# Altium schematic sheet Charging.SchDoc
size A; SheetNumber: 6
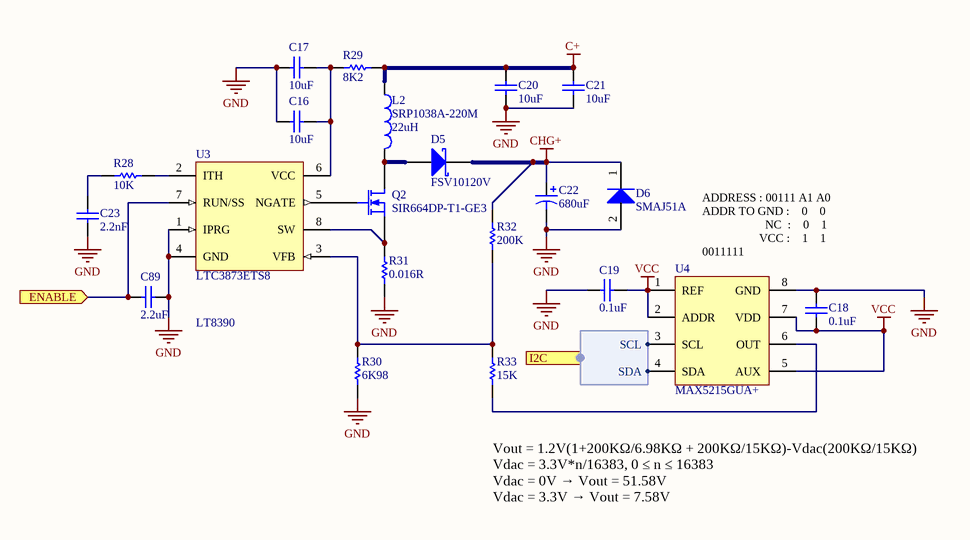
[diagram p0: Charging.SchDoc]

## Parts
C16  value 10uF  [C0603[1608X92]]  (hidden comment: 10uF 16V 0603)
C17  value 10uF  [C0603[1608X92]]  (hidden comment: 10uF 16V 0603)
C18  value 0.1uF  [C0603[1608X92]]  (hidden comment: 0.1uF 6.3V 0603)
C19  value 0.1uF  [C0603[1608X92]]  (hidden comment: 0.1uF 6.3V 0603)
C20  value 10uF  [C1206[3216X160]]  (hidden comment: 10uF 50V 1206)
C21  value 10uF  [C1206[3216X160]]  (hidden comment: 10uF 50V 1206)
C22  value 680uF  [CAP-ELECTROLYTIC[10.0x12.6]]  (hidden comment: 180uF 50V)
C23  value 2.2nF  [C0603[1608X92]]  (hidden comment: 2.2nF 50V 0603)
C89  value 2.2uF  [C0603[1608X92]]  (hidden comment: 2.2uF 10V 0603)
D5  FSV10120V  [TO-277]
D6  SMAJ51A  [DO-214AC]
L2  SRP1038A-220M  value 22uH  [SRP1038A]
Q2  SIR664DP-T1-GE3  [PowerPak-8]
R28  value 10K  [R0603[1608]]  (hidden comment: 10K 1% 0603)
R29  value 8K2  [R0603[1608]]  (hidden comment: 8K2 1% 0603)
R30  value 6K98  [R0603[1608]]  (hidden comment: 6K98 1% 0603)
R31  value 0.016R  [R1206[3216]]  (hidden comment: 0.016R 1% 1206)
R32  value 200K  [R0603[1608]]  (hidden comment: 200K 1% 0603)
R33  value 15K  [R0603[1608]]  (hidden comment: 15K 1% 0603)
U3  LTC3873ETS8  [SOT-23-8]
U4  MAX5215GUA+  [MSOP-8]

## Ports
ENABLE (in), I2C (harness I2C)

## Harnesses
I2C: SCL, SDA

## Nets
C+: C20.2 C21.2 L2.1 R29.2
CHG+: C22.1 D5.1(K) D6.1(K) R32.2
GND: C16.1 C17.1 C18.1 C19.2 C20.1 C21.1 C22.2 C23.1 C89.2 D6.2(A) R30.1 R31.1 U3.1(IPRG) U3.4(GND) U4.8(GND)
VCC: C18.2 C19.1 U4.1(REF) U4.2(ADDR) U4.5(AUX) U4.7(VDD)
ENABLE: C89.1 U3.7(RUN/SS) ; port ENABLE
NetC16_2: C16.2 C17.2 R29.1 U3.6(VCC)
NetC23_2: C23.2 R28.1
NetD5_2: D5.2(A) L2.2 Q2.3(D)
NetQ2_1: Q2.1(S) R31.2 U3.8(SW)
NetQ2_2: Q2.2(G) U3.5(NGATE)
NetR28_2: R28.2 U3.2(ITH)
NetR30_2: R30.2 R32.1 R33.2 U3.3(VFB)
NetR33_1: R33.1 U4.6(OUT)
NetU4_3: U4.3(SCL) ; port I2C.SCL
NetU4_4: U4.4(SDA) ; port I2C.SDA

## Notes on the sheet
- ADDRESS : 00111 A1 A0
  ADDR TO GND :    0    0
  NC  :    0    1
  VCC :    1    1
  0011111
- LT8390
- Vout = 1.2V(1+200KΩ/6.98KΩ + 200KΩ/15KΩ)-Vdac(200KΩ/15KΩ)
  Vdac = 3.3V*n/16383, 0 ≤ n ≤ 16383
  Vdac = 0V → Vout = 51.58V
  Vdac = 3.3V → Vout = 7.58V

## Library data of the parts
C16 C17 = CAP_10uF_16V_0603_10%: 10uF 16V 10% 0603 (1608 Metric); PartNumber: GRM188R61C106KAALD; Manufacturer: Murata; TemperatureCoefficient: X5R; Mounting Technology: Surface Mount; PackageReference: 0603; PackageDescription: 0603 (1608 Metric); Voltage: 16V; Tolerance: 10%
C18 C19 = CAP_0.1uF_6.3V_0603_10%: 0.1uF 6.3V 10% 0603 (1608 Metric); PartNumber: GRM188R70J104KA01D; Manufacturer: Murata; Mounting Technology: Surface Mount; PackageReference: 0603; PackageDescription: 0603 (1608 Metric); Voltage: 6.3V; Tolerance: 10%
C20 C21 = CAP_10uF_50V_1206_20%: 10uF 50V 20% 1206 (3216 Metric); PartNumber: UMK316BBJ106ML-T; Manufacturer: Taiyo Yuden; Tolerance: 20%; Mounting Technology: Surface Mount; PackageReference: 1206; PackageDescription: 1206 (3216 Metric); Voltage: 50V
C22 = CAP_180uF_50V_20%: 180uF 50V 20%; PartNumber: PCR1H181MCL1GS; Manufacturer: Nichicon; PackageReference: 1H; PackageDescription: 5mm; Mounting Technology: Surface Mount; Voltage: 50V; Tolerance: 20%
C23 = CAP_2.2nF_50V_0603_5%: 2.2nF 50V 5% 0603 (1608 Metric); PartNumber: GRM1885C1H222JA01D; Manufacturer: Murata; TemperatureCoefficient: C0G; Mounting Technology: Surface Mount; PackageReference: 0603; PackageDescription: 0603 (1608 Metric); Voltage: 50V; Tolerance: 5%
C89 = CAP_2.2uF_10V_0603_10%: 2.2uF 10V 10% 0603 (1608 Metric); PartNumber: GRT188R61A225KE13D; Manufacturer: Murata; TemperatureCoefficient: X5R; Mounting Technology: Surface Mount; PackageReference: 0603; PackageDescription: 0603 (1608 Metric); Voltage: 10V; Tolerance: 10%
D5 = FSV10120V: Schottky Diodes & Rectifiers 10 Amp 120V Schottky Rectifier; Manufacturer: Fairchild Semiconductor; PackageReference: TO-277-3; PartNumber: FSV10120V; Mounting Technology: Surface Mount
D6 = SMAJ51A-E3/61: Manufacturer: Vishay; PartNumber: SMAJ51A-E3/61; PackageReference: DO-214AC; PackageDescription: DO-214AC, 2 Leads; Mounting Technology: Surface Mount
L2 = SRP1038A-220M: 22uH 20% 7A 1038; Manufacturer: Bourns; PackageReference: SRP1038A; PartNumber: SRP1038A-220M; Mounting Technology: Surface Mount; Current: 7A
Q2 = SIR664DP-T1-GE3: N-Channel MOSFET; Manufacturer: Vishay; PartNumber: SIR664DP-T1-GE3; Mounting Technology: Surface Mount; PackageReference: PowerPAK-8
R28 = RES_10K_0603_1%: 10K 0.25W 1% 0603 (1005 Metric); Manufacturer: Vishay / Dale; PartNumber: CRCW060310K0FKEAHP; Tolerance: 1%; Power: 0.25W; Mounting Technology: Surface Mount; PackageReference: 0603; PackageDescription: 0603 (1608 Metric); ComponentLink1Description: Datasheet; ComponentLink1URL: http://www.vishay.com/docs/20065/rcse3.pdf
R29 = RES_8K2_0603_1%: 8K2 0.25W 1% 0603 (1005 Metric); Manufacturer: Vishay; PartNumber: CRCW06038K20FKEAHP; Tolerance: 1%; Power: 0.25W; Mounting Technology: Surface Mount; PackageReference: 0603; PackageDescription: 0603 (1608 Metric); ComponentLink1Description: Datasheet; ComponentLink1URL: http://www.vishay.com/docs/20043/crcwhpe3.pdf
R30 = RES_6K98_0603_1%: 6K98 0.25W 1% 0603 (1005 Metric); Manufacturer: Vishay / Dale; PartNumber: CRCW06036K98FKEAHP; Tolerance: 1%; Power: 0.25W; Mounting Technology: Surface Mount; PackageReference: 0603; PackageDescription: 0603 (1608 Metric); ComponentLink1Description: Datasheet; ComponentLink1URL: http://www.vishay.com/docs/20043/crcwhpe3.pdf
R31 = RES_0.016R_1206_1%: 0.016R 1W 1% 1206 (3216 Metric); Manufacturer: Panasonic; PartNumber: ERJ-8CWFR016V; Power: 1W; Tolerance: 1%; Mounting Technology: Surface Mount; PackageReference: 1206; PackageDescription: 1206 (3216 Metric); ComponentLink1Description: Datasheet; ComponentLink1URL: https://industrial.panasonic.com/cdbs/www-data/pdf/RDA0000/AOA0000C239.pdf
R32 = RES_200K_0603_1%: 200K 0.25W 1% 0603 (1005 Metric); Manufacturer: Rohm Semiconductor; PartNumber: ESR03EZPJ204; Tolerance: 5%; Power: 0.25W; Mounting Technology: Surface Mount; PackageReference: 0603; PackageDescription: 0603 (1608 Metric); ComponentLink1Description: Datasheet; ComponentLink1URL: http://www.vishay.com/docs/20043/crcwhpe3.pdf
R33 = RES_15K_0603_1%: 15K 0.25W 1% 0603 (1005 Metric); Manufacturer: Vishay / Dale; PartNumber: CRCW060315K0FKEAHP; Tolerance: 1%; Power: 0.25W; Mounting Technology: Surface Mount; PackageReference: 0603; PackageDescription: 0603 (1608 Metric); ComponentLink1Description: Datasheet; ComponentLink1URL: http://www.vishay.com/docs/20043/crcwhpe3.pdf
U3 = LTC3873ETS8: PartNumber: LTC3873ETS8#PBF; Manufacturer: Linear Technology; PackageReference: TSOT-23-8; Mounting Technology: Surface Mount
U4 = MAX5215GUA+: 14 Bit Digital to Analog Converter; Manufacturer: Maxim Integrated; PartNumber: MAX5215GUA+; Mounting Technology: Surface Mount; PackageReference: MSOP-8